# Altium schematic sheet ADC5G.SchDoc: FMC 5GS/s ADC/TDC
size 420 x 297 mm; Author: Agnieszka Bartkowicz; CompanyName: WUT ISE; DrawnBy: Agnieszka Bartkowicz; Engineer: Agnieszka Bartkowicz; Organization: WUT ISE; Address1: PW ISE; Address2: Nowowiejska 15/19 00-665 Warsaw; Address3: gyorka@o2.pl; SheetNumber: 2; SheetTotal: 13; ModifiedBy: -; CheckedDate: -; Title2: Title 2; DivGrp: WUT ISE; Designer: A. Bartkowicz
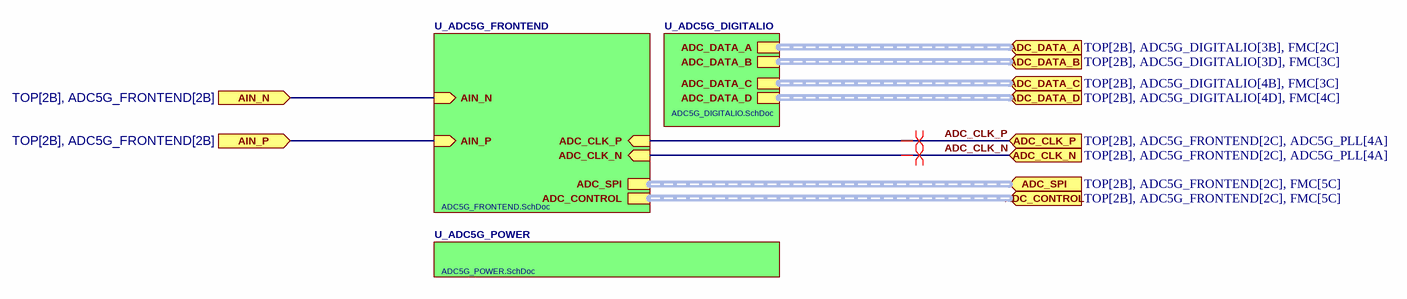
[diagram p0: ADC5G.SchDoc]

## Sub-sheets
U_ADC5G_DIGITALIO = ADC5G_DIGITALIO.SchDoc: ADC_DATA_A (harness ADC_DATA), ADC_DATA_B (harness ADC_DATA), ADC_DATA_D (harness ADC_DATA), ADC_DATA_C (harness ADC_DATA)
U_ADC5G_FRONTEND = ADC5G_FRONTEND.SchDoc: AIN_N (in), AIN_P (in), ADC_CLK_P (in), ADC_CLK_N (in), ADC_SPI (harness SPI), ADC_CONTROL (harness ADC_CONTROL)
U_ADC5G_POWER = ADC5G_POWER.SchDoc: no entries

## Ports
ADC_CLK_N (in, see TOP[2B], ADC5G_FRONTEND[2C], ADC5G_PLL[4A]), ADC_CLK_P (in, see TOP[2B], ADC5G_FRONTEND[2C], ADC5G_PLL[4A]), ADC_CONTROL (in, harness ADC_CONTROL, see TOP[2B], ADC5G_FRONTEND[2C], FMC[5C]), ADC_DATA_A (in, harness ADC_DATA, see TOP[2B], ADC5G_DIGITALIO[3B], FMC[2C]), ADC_DATA_B (in, harness ADC_DATA, see TOP[2B], ADC5G_DIGITALIO[3D], FMC[3C]), ADC_DATA_C (in, harness ADC_DATA, see TOP[2B], ADC5G_DIGITALIO[4B], FMC[3C]), ADC_DATA_D (in, harness ADC_DATA, see TOP[2B], ADC5G_DIGITALIO[4D], FMC[4C]), ADC_SPI (in, harness SPI, see TOP[2B], ADC5G_FRONTEND[2C], FMC[5C]), AIN_N (in, see TOP[2B], ADC5G_FRONTEND[2B]), AIN_P (in, see TOP[2B], ADC5G_FRONTEND[2B])

## Nets
ADC_CLK_N: port ADC_CLK_N, sheet U_ADC5G_FRONTEND/ADC_CLK_N
ADC_CLK_P: port ADC_CLK_P, sheet U_ADC5G_FRONTEND/ADC_CLK_P
AIN_N: port AIN_N, sheet U_ADC5G_FRONTEND/AIN_N
AIN_P: port AIN_P, sheet U_ADC5G_FRONTEND/AIN_P

## Buses and harness runs
harness port ADC_CONTROL = sheet U_ADC5G_FRONTEND/ADC_CONTROL
harness port ADC_DATA_A = sheet U_ADC5G_DIGITALIO/ADC_DATA_A
harness port ADC_DATA_B = sheet U_ADC5G_DIGITALIO/ADC_DATA_B
harness port ADC_DATA_C = sheet U_ADC5G_DIGITALIO/ADC_DATA_C
harness port ADC_DATA_D = sheet U_ADC5G_DIGITALIO/ADC_DATA_D
harness port ADC_SPI = sheet U_ADC5G_FRONTEND/ADC_SPI

## Layout directives
differential pair: ADC_CLK_N, ADC_CLK_P

## Notes on the sheet
- Project/Equipment
- Document
- Designer
- Drawn by
- Check.by
- Copyright WUT ISE 2024.
  This documentation describes Open Hardware and is licensed under the CERN OHL v.2. You may redistribute and modify this documentation under the terms of the CERN OHL v.2. (http://ohwr.org/CERNOHL). This documentation is distributed WITHOUT ANY EXPRESS OR IMPLIED WARRANTY, INCLUDING OF MERCHANTABILITY, SATISFACTORY QUALITY AND FITNESS FOR A PARTICULAR PURPOSE. Please see the CERN OHL v.2 for applicable conditions.
- Contact
- File
- Last Mod.
- Print Date
- Sheet
- Size
- A3
- of
- Rev